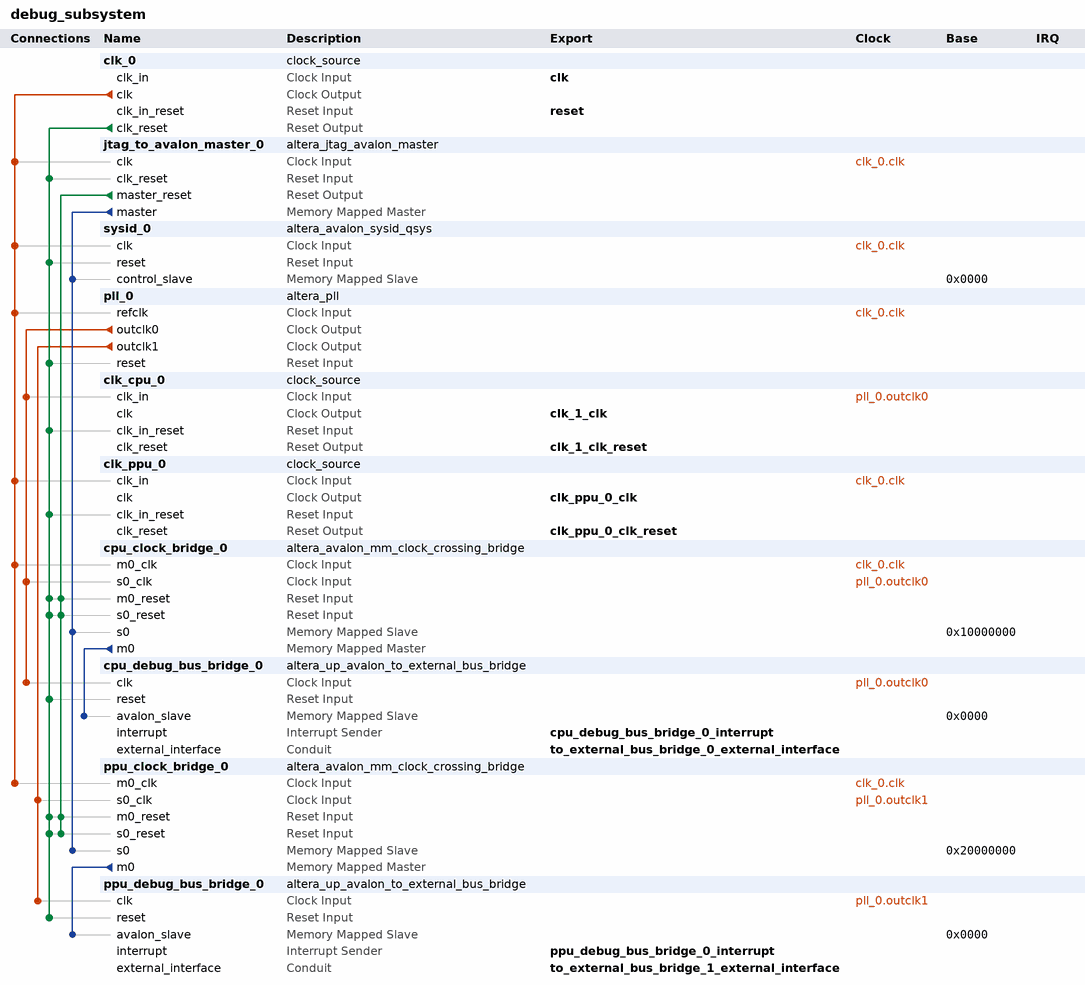
[diagram p0: system contents]
# Platform Designer (Qsys) system debug_subsystem, Cyclone V 5CEBA4F23C7
# Parameters at their usual value, and those the tool derives, are not listed.
package require -exact qsys 21.1
create_system debug_subsystem
set_project_property DEVICE_FAMILY {Cyclone V}
set_project_property DEVICE 5CEBA4F23C7

add_instance clk_0 clock_source 21.1
set_instance_parameter_value clk_0 clockFrequency 50000000

add_instance jtag_to_avalon_master_0 altera_jtag_avalon_master 21.1

add_instance sysid_0 altera_avalon_sysid_qsys 21.1
set_instance_parameter_value sysid_0 id -1432791706

add_instance pll_0 altera_pll 21.1
set_instance_parameter_value pll_0 gui_device_speed_grade 1
set_instance_parameter_value pll_0 gui_number_of_clocks 2
set_instance_parameter_value pll_0 gui_operation_mode direct
set_instance_parameter_value pll_0 gui_output_clock_frequency0 1.789773
set_instance_parameter_value pll_0 gui_output_clock_frequency1 5.369318
set_instance_parameter_value pll_0 gui_pll_mode {Integer-N PLL}
set_instance_parameter_value pll_0 gui_reference_clock_frequency 50.0
set_instance_parameter_value pll_0 gui_use_locked false

add_instance clk_cpu_0 clock_source 21.1
set_instance_parameter_value clk_cpu_0 clockFrequency 1789773

add_instance clk_ppu_0 clock_source 21.1
set_instance_parameter_value clk_ppu_0 clockFrequency 5369318

add_instance cpu_clock_bridge_0 altera_avalon_mm_clock_crossing_bridge 21.1
set_instance_parameter_value cpu_clock_bridge_0 ADDRESS_WIDTH 16
set_instance_parameter_value cpu_clock_bridge_0 COMMAND_FIFO_DEPTH 4
set_instance_parameter_value cpu_clock_bridge_0 DATA_WIDTH 32
set_instance_parameter_value cpu_clock_bridge_0 MASTER_SYNC_DEPTH 2
set_instance_parameter_value cpu_clock_bridge_0 MAX_BURST_SIZE 1
set_instance_parameter_value cpu_clock_bridge_0 RESPONSE_FIFO_DEPTH 4
set_instance_parameter_value cpu_clock_bridge_0 SLAVE_SYNC_DEPTH 2
set_instance_parameter_value cpu_clock_bridge_0 USE_AUTO_ADDRESS_WIDTH 0

add_instance cpu_debug_bus_bridge_0 altera_up_avalon_to_external_bus_bridge 18.0
set_instance_parameter_value cpu_debug_bus_bridge_0 addr_size 64
set_instance_parameter_value cpu_debug_bus_bridge_0 addr_size_multiplier Kbytes
set_instance_parameter_value cpu_debug_bus_bridge_0 data_size 16

add_instance ppu_clock_bridge_0 altera_avalon_mm_clock_crossing_bridge 21.1
set_instance_parameter_value ppu_clock_bridge_0 ADDRESS_WIDTH 16
set_instance_parameter_value ppu_clock_bridge_0 COMMAND_FIFO_DEPTH 4
set_instance_parameter_value ppu_clock_bridge_0 DATA_WIDTH 32
set_instance_parameter_value ppu_clock_bridge_0 MASTER_SYNC_DEPTH 2
set_instance_parameter_value ppu_clock_bridge_0 MAX_BURST_SIZE 1
set_instance_parameter_value ppu_clock_bridge_0 RESPONSE_FIFO_DEPTH 4
set_instance_parameter_value ppu_clock_bridge_0 SLAVE_SYNC_DEPTH 2
set_instance_parameter_value ppu_clock_bridge_0 USE_AUTO_ADDRESS_WIDTH 0

add_instance ppu_debug_bus_bridge_0 altera_up_avalon_to_external_bus_bridge 18.0
set_instance_parameter_value ppu_debug_bus_bridge_0 addr_size 64
set_instance_parameter_value ppu_debug_bus_bridge_0 addr_size_multiplier Kbytes
set_instance_parameter_value ppu_debug_bus_bridge_0 data_size 16

# connections
add_connection clk_0.clk clk_ppu_0.clk_in clock
add_connection clk_0.clk cpu_clock_bridge_0.m0_clk clock
add_connection clk_0.clk jtag_to_avalon_master_0.clk clock
add_connection clk_0.clk pll_0.refclk clock
add_connection clk_0.clk ppu_clock_bridge_0.m0_clk clock
add_connection clk_0.clk sysid_0.clk clock
add_connection pll_0.outclk0 clk_cpu_0.clk_in clock
add_connection pll_0.outclk0 cpu_clock_bridge_0.s0_clk clock
add_connection pll_0.outclk0 cpu_debug_bus_bridge_0.clk clock
add_connection pll_0.outclk1 ppu_clock_bridge_0.s0_clk clock
add_connection pll_0.outclk1 ppu_debug_bus_bridge_0.clk clock
add_connection clk_0.clk_reset clk_cpu_0.clk_in_reset reset
add_connection clk_0.clk_reset clk_ppu_0.clk_in_reset reset
add_connection clk_0.clk_reset cpu_clock_bridge_0.m0_reset reset
add_connection clk_0.clk_reset cpu_clock_bridge_0.s0_reset reset
add_connection clk_0.clk_reset cpu_debug_bus_bridge_0.reset reset
add_connection clk_0.clk_reset jtag_to_avalon_master_0.clk_reset reset
add_connection clk_0.clk_reset pll_0.reset reset
add_connection clk_0.clk_reset ppu_clock_bridge_0.m0_reset reset
add_connection clk_0.clk_reset ppu_clock_bridge_0.s0_reset reset
add_connection clk_0.clk_reset ppu_debug_bus_bridge_0.reset reset
add_connection clk_0.clk_reset sysid_0.reset reset
add_connection jtag_to_avalon_master_0.master_reset cpu_clock_bridge_0.m0_reset reset
add_connection jtag_to_avalon_master_0.master_reset cpu_clock_bridge_0.s0_reset reset
add_connection jtag_to_avalon_master_0.master_reset ppu_clock_bridge_0.m0_reset reset
add_connection jtag_to_avalon_master_0.master_reset ppu_clock_bridge_0.s0_reset reset
add_connection cpu_clock_bridge_0.m0 cpu_debug_bus_bridge_0.avalon_slave avalon
set_connection_parameter_value cpu_clock_bridge_0.m0/cpu_debug_bus_bridge_0.avalon_slave baseAddress 0x0000
add_connection jtag_to_avalon_master_0.master cpu_clock_bridge_0.s0 avalon
set_connection_parameter_value jtag_to_avalon_master_0.master/cpu_clock_bridge_0.s0 baseAddress 0x10000000
add_connection jtag_to_avalon_master_0.master ppu_clock_bridge_0.s0 avalon
set_connection_parameter_value jtag_to_avalon_master_0.master/ppu_clock_bridge_0.s0 baseAddress 0x20000000
add_connection jtag_to_avalon_master_0.master sysid_0.control_slave avalon
set_connection_parameter_value jtag_to_avalon_master_0.master/sysid_0.control_slave baseAddress 0x0000
add_connection ppu_clock_bridge_0.m0 ppu_debug_bus_bridge_0.avalon_slave avalon
set_connection_parameter_value ppu_clock_bridge_0.m0/ppu_debug_bus_bridge_0.avalon_slave baseAddress 0x0000

# exported interfaces
add_interface clk clock sink
set_interface_property clk EXPORT_OF clk_0.clk_in
add_interface clk_1_clk clock source
set_interface_property clk_1_clk EXPORT_OF clk_cpu_0.clk
add_interface clk_1_clk_reset reset source
set_interface_property clk_1_clk_reset EXPORT_OF clk_cpu_0.clk_reset
add_interface clk_ppu_0_clk clock source
set_interface_property clk_ppu_0_clk EXPORT_OF clk_ppu_0.clk
add_interface clk_ppu_0_clk_reset reset source
set_interface_property clk_ppu_0_clk_reset EXPORT_OF clk_ppu_0.clk_reset
add_interface cpu_debug_bus_bridge_0_interrupt interrupt sender
set_interface_property cpu_debug_bus_bridge_0_interrupt EXPORT_OF cpu_debug_bus_bridge_0.interrupt
add_interface ppu_debug_bus_bridge_0_interrupt interrupt sender
set_interface_property ppu_debug_bus_bridge_0_interrupt EXPORT_OF ppu_debug_bus_bridge_0.interrupt
add_interface reset reset sink
set_interface_property reset EXPORT_OF clk_0.clk_in_reset
add_interface to_external_bus_bridge_0_external_interface conduit end
set_interface_property to_external_bus_bridge_0_external_interface EXPORT_OF cpu_debug_bus_bridge_0.external_interface
add_interface to_external_bus_bridge_1_external_interface conduit end
set_interface_property to_external_bus_bridge_1_external_interface EXPORT_OF ppu_debug_bus_bridge_0.external_interface

set_interconnect_requirement {$system} qsys_mm.clockCrossingAdapter HANDSHAKE
set_interconnect_requirement {$system} qsys_mm.enableEccProtection FALSE
set_interconnect_requirement {$system} qsys_mm.insertDefaultSlave FALSE
set_interconnect_requirement {$system} qsys_mm.maxAdditionalLatency 1

save_system debug_subsystem.qsys
